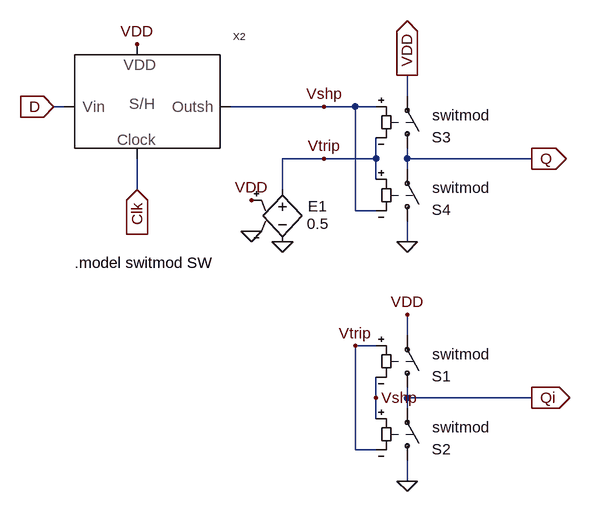
[diagram p0: schematic DFF.asc]
DFF.asc, the LTspice schematic file:
Version 4
SHEET 1 6308 700
WIRE 1600 -720 1600 -752
WIRE 1072 -704 1056 -704
WIRE 1472 -704 1328 -704
WIRE 1520 -704 1472 -704
WIRE 1552 -704 1520 -704
WIRE 1472 -624 1408 -624
WIRE 1552 -624 1552 -656
WIRE 1552 -624 1472 -624
WIRE 1600 -624 1600 -640
WIRE 1792 -624 1600 -624
WIRE 1600 -608 1600 -624
WIRE 1552 -592 1552 -624
WIRE 1184 -576 1184 -624
WIRE 1408 -576 1408 -624
WIRE 1520 -544 1520 -704
WIRE 1552 -544 1520 -544
WIRE 1600 -496 1600 -528
WIRE 1600 -352 1600 -384
WIRE 1552 -336 1520 -336
WIRE 1552 -256 1552 -288
WIRE 1600 -256 1600 -272
WIRE 1792 -256 1600 -256
WIRE 1600 -240 1600 -256
WIRE 1552 -224 1552 -256
WIRE 1520 -176 1520 -336
WIRE 1552 -176 1520 -176
WIRE 1600 -128 1600 -160
FLAG 1600 -752 VDD
IOPIN 1600 -752 Out
FLAG 1600 -496 0
FLAG 1056 -704 D
IOPIN 1056 -704 In
FLAG 1792 -624 Q
IOPIN 1792 -624 Out
FLAG 1184 -800 VDD
FLAG 1184 -576 Clk
IOPIN 1184 -576 In
FLAG 1472 -704 Vshp
FLAG 1472 -624 Vtrip
FLAG 1408 -496 0
FLAG 1360 -512 0
FLAG 1360 -560 VDD
FLAG 1600 -128 0
FLAG 1792 -256 Qi
IOPIN 1792 -256 Out
FLAG 1552 -256 Vshp
FLAG 1520 -336 Vtrip
FLAG 1600 -384 VDD
SYMBOL sw 1600 -624 M180
WINDOW 3 24 -12 Left 0
WINDOW 38 39 67 Left 0
WINDOW 0 38 33 Left 0
SYMATTR Value ""
SYMATTR SpiceModel switmod
SYMATTR InstName S3
SYMBOL sw 1600 -512 M180
WINDOW 3 24 -12 Left 0
WINDOW 38 39 67 Left 0
WINDOW 0 38 33 Left 0
SYMATTR Value ""
SYMATTR SpiceModel switmod
SYMATTR InstName S4
SYMBOL Sample_and_hold 1088 -640 R0
SYMATTR InstName X2
SYMBOL e 1408 -592 R0
WINDOW 0 39 41 Left 0
WINDOW 3 38 68 Left 0
SYMATTR InstName E1
SYMATTR Value 0.5
SYMBOL sw 1600 -256 M180
WINDOW 3 24 -12 Left 0
WINDOW 38 39 67 Left 0
WINDOW 0 38 33 Left 0
SYMATTR Value ""
SYMATTR SpiceModel switmod
SYMATTR InstName S1
SYMBOL sw 1600 -144 M180
WINDOW 3 24 -12 Left 0
WINDOW 38 39 67 Left 0
WINDOW 0 38 33 Left 0
SYMATTR Value ""
SYMATTR SpiceModel switmod
SYMATTR InstName S2
TEXT 1088 -464 Left 0 !.model switmod SW

The netlist it stands for:
* DFF.asc
S3 Q VDD Vshp Vtrip switmod
S4 0 Q Vtrip Vshp switmod
XX2 D Vshp Clk VDD Sample_and_hold  ; pins Vin Outsh Clock VDD
E1 Vtrip 0 VDD 0 0.5
S1 Qi VDD Vtrip Vshp switmod
S2 0 Qi Vshp Vtrip switmod
.model switmod SW
.backanno
.end